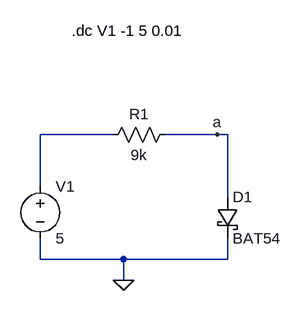
[diagram p0: schematic Lab2 Part 1 (20101299).asc]
Lab2 Part 1 (20101299).asc, the LTspice schematic file:
Version 4
SHEET 1 880 680
WIRE 160 16 48 16
WIRE 320 16 240 16
WIRE 336 16 320 16
WIRE 48 96 48 16
WIRE 336 112 336 16
WIRE 48 208 48 176
WIRE 176 208 48 208
WIRE 336 208 336 176
WIRE 336 208 176 208
WIRE 176 240 176 208
FLAG 176 240 0
FLAG 320 16 a
SYMBOL voltage 48 80 R0
WINDOW 123 0 0 Left 0
WINDOW 39 0 0 Left 0
SYMATTR InstName V1
SYMATTR Value 5
SYMBOL res 256 0 R90
WINDOW 0 0 56 VBottom 2
WINDOW 3 32 56 VTop 2
SYMATTR InstName R1
SYMATTR Value 9k
SYMBOL schottky 320 112 R0
SYMATTR InstName D1
SYMATTR Value BAT54
SYMATTR Description Diode
SYMATTR Type diode
TEXT 96 -144 Left 2 !.dc V1 -1 5 0.01

The netlist it stands for:
* Lab2 Part 1 (20101299).asc
V1 N001 0 5
R1 a N001 9k
D1 a 0 BAT54
.model D D
.lib standard.dio
.dc V1 -1 5 0.01
.backanno
.end

* Results of the author's LTspice run, read from the files saved beside the schematic
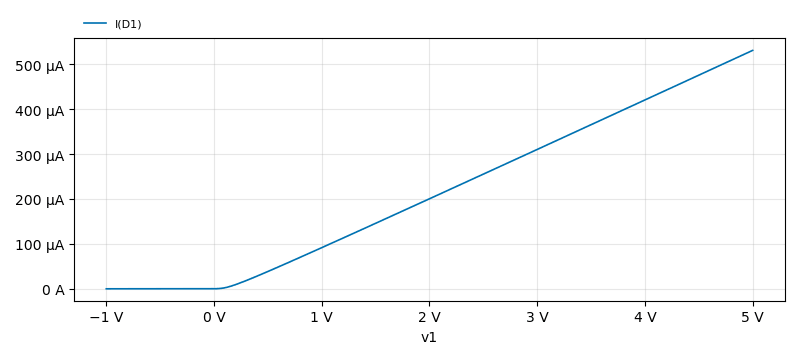
[diagram p1: DC transfer characteristic of Lab2 Part 1 (20101299).asc, plotted from the saved traces]
* DC transfer characteristic, 1 run:
*   I(D1): -100 nA at v1=-1 V, 530.8 µA at v1=5 V, min -100 nA, max 530.8 µA